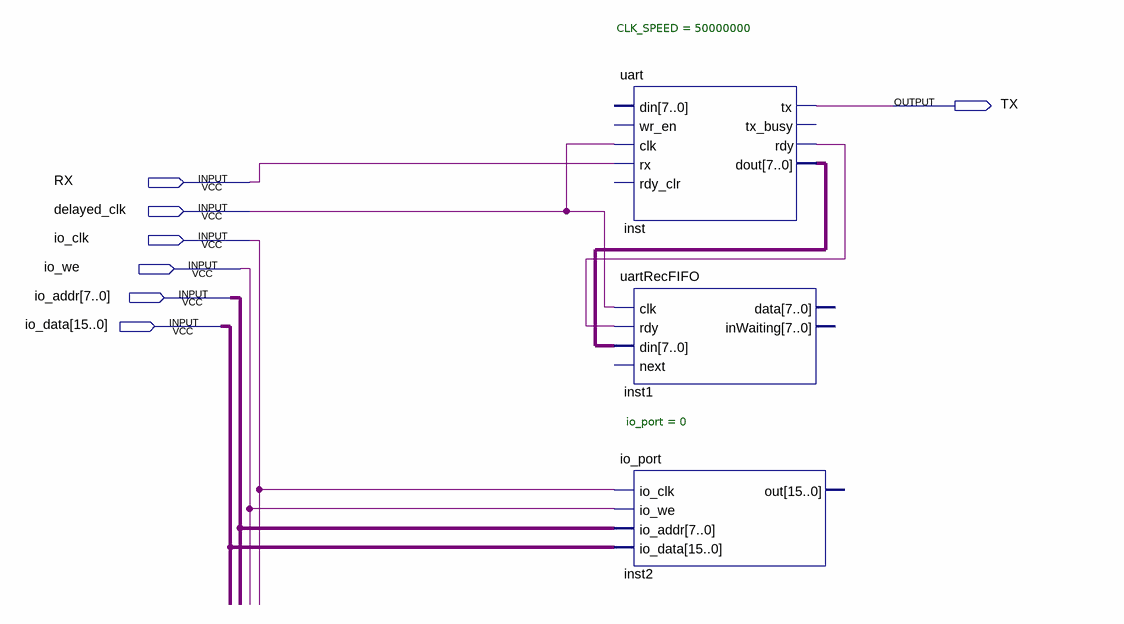
[diagram p0: schematic sheet]
// Quartus schematic vga.bdf as structural Verilog: 3 symbols, 7 pins
module vga (
  input  RX,
  input  delayed_clk,
  input  io_clk,
  input  io_we,
  input  [7:0] io_addr,
  input  [15:0] io_data,
  output TX
);

  wire inst_rdy;
  wire [7:0] inst_dout;

  uart #(.CLK_SPEED(50000000)) inst (
    .clk(delayed_clk), .rx(RX), .tx(TX), .rdy(inst_rdy), .dout(inst_dout));  // open: din, wr_en, rdy_clr, tx_busy
  uartRecFIFO inst1 (.clk(delayed_clk), .rdy(inst_rdy), .din(inst_dout));  // open: next, data, inWaiting
  io_port #(.io_port(0)) inst2 (.io_clk(io_clk), .io_we(io_we), .io_addr(io_addr), .io_data(io_data));  // open: out
endmodule
